# Altium schematic sheet Power.SchDoc
size A4
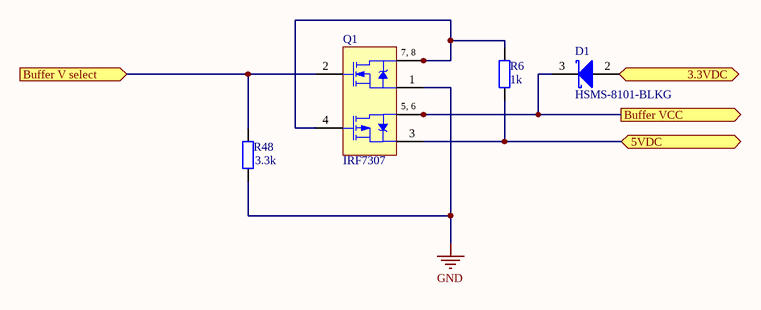
[diagram p0: Power.SchDoc]

## Parts
D1  HSMS-8101-BLKG  [SOT-23_N]
Q1  IRF7307  [SO-8_N]
R6  value 1k  [R_0603]  (hidden comment: Res)
R48  value 3.3k  [R_0603]  (hidden comment: Res)

## Ports
3.3VDC, 5VDC, Buffer V select (in), Buffer VCC (out)

## Nets
GND: Q1.1(S1) R48.1
3.3VDC: D1.2(A) ; port 3.3VDC
5VDC: Q1.3(S2) R6.2 ; port 5VDC
Buffer V select: Q1.2(G1) R48.2 ; port Buffer V select
Buffer VCC: D1.3(K) Q1.5(D2) Q1.6(D2) ; port Buffer VCC
NetQ1_4: Q1.4(G2) Q1.7(D1) Q1.8(D1) R6.1

## Notes on the sheet
- (in symbol IRF7307) 7, 8; 5, 6

## Library data of the parts
D1 = D Schottky: Schottky Diode; pin to pad: 1>2; Published: 8-Jun-2000; LatestRevisionDate: 17-Jul-2002; LatestRevisionNote: Re-released for DXP Platform.; PackageReference: SMB; Publisher: Altium Limited; PackageDescription: DO-214-AA/SMB; 2 C-Bend Leads; Body 5.3 x 3.6 mm, inc. leads (LxW); Code_JEDEC: DO-214-AA
Q1 = IRF7307: HEXFET Power MOSFET; Published: 8-Jun-2000; LatestRevisionDate: 13-Apr-2006; LatestRevisionNote: IPC-7351 Footprint Added.; DatasheetVersion: 25-Aug-1997; PackageVersion: Feb-2001; PackageReference: SO-8; Publisher: Altium Limited; PackageDescription: 8-Pin Plastic Small Outline Integrated Circuit 1.27 mm Pitch; Code_JEDEC: MS-012-AA; Code_IPC: SOIC127P600-8; ComponentLink1Description: Manufacturer Link; ComponentLink1URL: http://www.irf.com/; ComponentLink2Description: Datasheet; ComponentLink2URL: http://www.irf.com/product-info/datasheets/data/IRHG6110.pdf
R6 R48 = Res2: Resistor; Published: 8-Jun-2000; LatestRevisionDate: 17-Jul-2002; LatestRevisionNote: Re-released for DXP Platform.; PackageReference: AXIAL-0.4; Publisher: Altium Limited; PackageDescription: Axial Device, Thru-Hole; 2 Leads; 0.4 in Pin Spacing